# EAGLE design v3 (EAGLE 6.3)
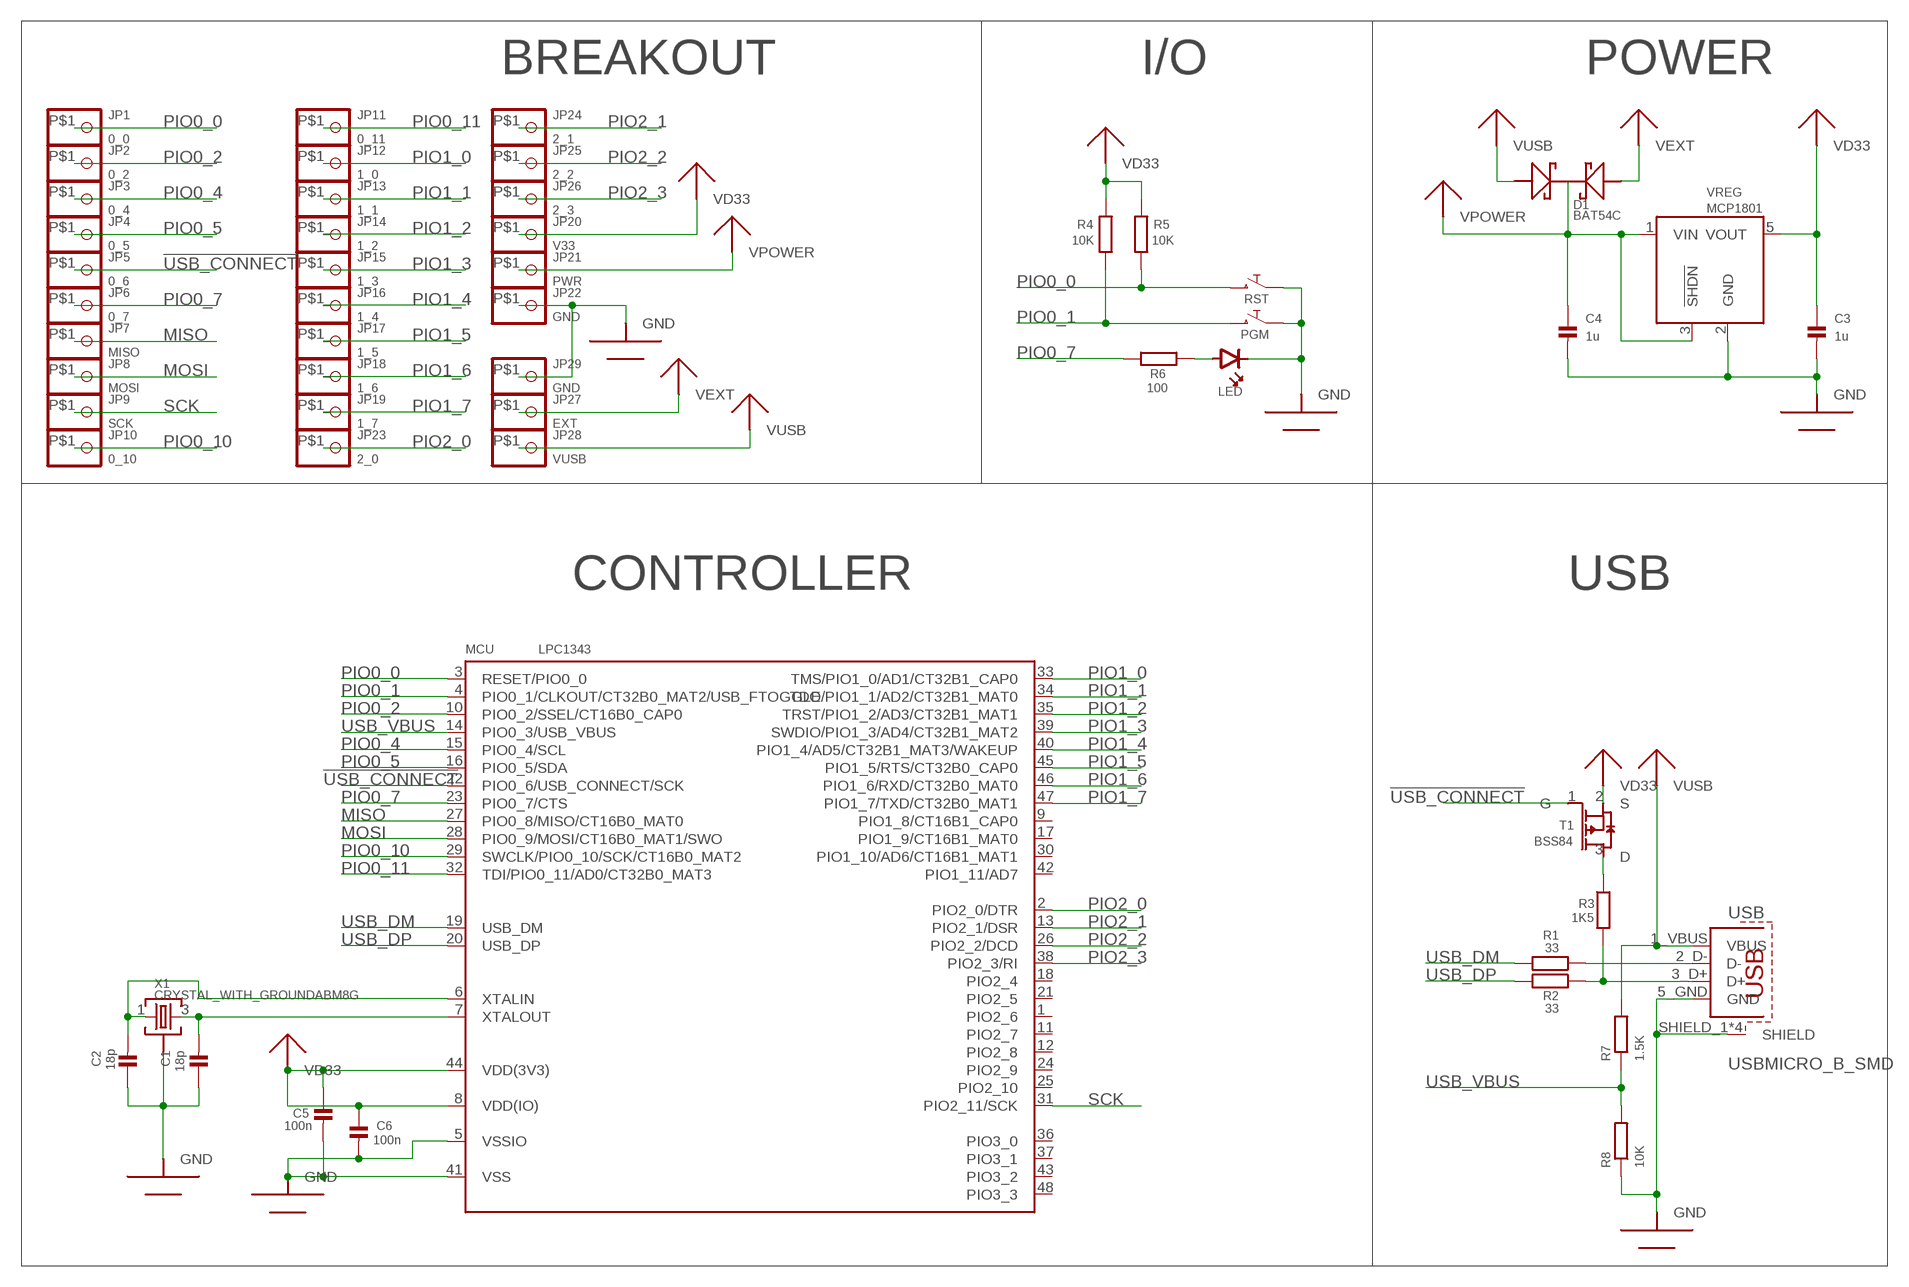
[diagram p0: schematic, sheet 1]

## Parts
C1  18p  CAP_CERAMIC0603  [0603]
C2  18p  CAP_CERAMIC0603  [0603]
C3  1u  CAP_CERAMIC0603  [0603]
C4  1u  CAP_CERAMIC0603  [0603]
C5  100n  CAP_CERAMIC0603  [0603]
C6  100n  CAP_CERAMIC0603  [0603]
D1  BAT54C  [SOT323]
JP1  0_0  HEADER-1X1SMD_MEDIUM  [PCB_MEDIUM_RECT_PAD]
JP2  0_2  HEADER-1X1SMD_MEDIUM  [PCB_MEDIUM_RECT_PAD]
JP3  0_4  HEADER-1X1SMD_MEDIUM  [PCB_MEDIUM_RECT_PAD]
JP4  0_5  HEADER-1X1SMD_MEDIUM  [PCB_MEDIUM_RECT_PAD]
JP5  0_6  HEADER-1X1SMD_MEDIUM  [PCB_MEDIUM_RECT_PAD]
JP6  0_7  HEADER-1X1SMD_MEDIUM  [PCB_MEDIUM_RECT_PAD]
JP7  MISO  HEADER-1X1SMD_MEDIUM  [PCB_MEDIUM_RECT_PAD]
JP8  MOSI  HEADER-1X1SMD_MEDIUM  [PCB_MEDIUM_RECT_PAD]
JP9  SCK  HEADER-1X1SMD_MEDIUM  [PCB_MEDIUM_RECT_PAD]
JP10  0_10  HEADER-1X1SMD_MEDIUM  [PCB_MEDIUM_RECT_PAD]
JP11  0_11  HEADER-1X1SMD_MEDIUM  [PCB_MEDIUM_RECT_PAD]
JP12  1_0  HEADER-1X1SMD_MEDIUM  [PCB_MEDIUM_RECT_PAD]
JP13  1_1  HEADER-1X1SMD_MEDIUM  [PCB_MEDIUM_RECT_PAD]
JP14  1_2  HEADER-1X1SMD_MEDIUM  [PCB_MEDIUM_RECT_PAD]
JP15  1_3  HEADER-1X1SMD_MEDIUM  [PCB_MEDIUM_RECT_PAD]
JP16  1_4  HEADER-1X1SMD_MEDIUM  [PCB_MEDIUM_RECT_PAD]
JP17  1_5  HEADER-1X1SMD_MEDIUM  [PCB_MEDIUM_RECT_PAD]
JP18  1_6  HEADER-1X1SMD_MEDIUM  [PCB_MEDIUM_RECT_PAD]
JP19  1_7  HEADER-1X1SMD_MEDIUM  [PCB_MEDIUM_RECT_PAD]
JP20  V33  HEADER-1X1SMD_MEDIUM  [PCB_MEDIUM_RECT_PAD]
JP21  PWR  HEADER-1X1SMD_MEDIUM  [PCB_MEDIUM_RECT_PAD]
JP22  GND  HEADER-1X1SMD_MEDIUM  [PCB_MEDIUM_RECT_PAD]
JP23  2_0  HEADER-1X1SMD_MEDIUM  [PCB_MEDIUM_RECT_PAD]
JP24  2_1  HEADER-1X1SMD_MEDIUM  [PCB_MEDIUM_RECT_PAD]
JP25  2_2  HEADER-1X1SMD_MEDIUM  [PCB_MEDIUM_RECT_PAD]
JP26  2_3  HEADER-1X1SMD_MEDIUM  [PCB_MEDIUM_RECT_PAD]
JP27  EXT  HEADER-1X1SMD_LARGER  [PCB_LARGER_RECT_PAD]
JP28  VUSB  HEADER-1X1SMD_LARGER  [PCB_LARGER_RECT_PAD]
JP29  GND  HEADER-1X1SMD_LARGER  [PCB_LARGER_RECT_PAD]
LED  LED0603  [0603_POLAR]
MCU  LPC1343  LPC1343_QFP  [LQFP48]
PGM  PUSHBUTTONKMR2XX  [CK-KMR2]
R1  33  R-EU_0603  [0603]
R2  33  R-EU_0603  [0603]
R3  1K5  R-EU_0603  [0603]
R4  10K  R-EU_0603  [0603]
R5  10K  R-EU_0603  [0603]
R6  100  R-EU_0603  [0603]
R7  1.5K  R-EU_0603  [0603]
R8  10K  R-EU_0603  [0603]
RST  PUSHBUTTONKMR2XX  [CK-KMR2]
T1  BSS84  PMOS_ENH  [SOT23]
USB  USBMICRO_B_SMD  [MICRO_USB_B_SMD]
VREG  MCP1801  MCP180XSOT-23-5  [SOT-23-5]
X1  CRYSTAL_WITH_GROUNDABM8G  [ABM8G]

## Nets
!USB_CONNECT: JP5.P$1 MCU.22(PIO0_6/USB_CONNECT/SCK) T1.1(G)
GND: C1.1 C2.1 C3.2 C4.2 C5.2 C6.2 JP22.P$1 JP29.P$1 LED.K(CATHODE) MCU.5(VSSIO) MCU.41(VSS) PGM.P$1 PGM.P$2 R8.1 RST.P$1 RST.P$2 USB.5_GND(GND) USB.SHIELD_1(SHIELD) USB.SHIELD_2(SHIELD) USB.SHIELD_3(SHIELD) USB.SHIELD_4(SHIELD) VREG.2(GND) X1.2(GND) X1.4(GND)
MISO: JP7.P$1 MCU.27(PIO0_8/MISO/CT16B0_MAT0)
MOSI: JP8.P$1 MCU.28(PIO0_9/MOSI/CT16B0_MAT1/SWO)
N$1: C2.2 MCU.6(XTALIN) X1.1
N$2: C1.2 MCU.7(XTALOUT) X1.3
N$3: R3.1 T1.3(D)
N$4: R1.1 USB.2_D-(D-)
N$5: LED.A(ANODE) R6.1
PIO0_0: JP1.P$1 MCU.3(RESET/PIO0_0) R5.1 RST.P$3 RST.P$4
PIO0_1: MCU.4(PIO0_1/CLKOUT/CT32B0_MAT2/USB_FTOGGLE) PGM.P$3 PGM.P$4 R4.1
PIO0_2: JP2.P$1 MCU.10(PIO0_2/SSEL/CT16B0_CAP0)
PIO0_4: JP3.P$1 MCU.15(PIO0_4/SCL)
PIO0_5: JP4.P$1 MCU.16(PIO0_5/SDA)
PIO0_7: JP6.P$1 MCU.23(PIO0_7/CTS) R6.2
PIO0_10: JP10.P$1 MCU.29(SWCLK/PIO0_10/SCK/CT16B0_MAT2)
PIO0_11: JP11.P$1 MCU.32(TDI/PIO0_11/AD0/CT32B0_MAT3)
PIO1_0: JP12.P$1 MCU.33(TMS/PIO1_0/AD1/CT32B1_CAP0)
PIO1_1: JP13.P$1 MCU.34(TDO/PIO1_1/AD2/CT32B1_MAT0)
PIO1_2: JP14.P$1 MCU.35(TRST/PIO1_2/AD3/CT32B1_MAT1)
PIO1_3: JP15.P$1 MCU.39(SWDIO/PIO1_3/AD4/CT32B1_MAT2)
PIO1_4: JP16.P$1 MCU.40(PIO1_4/AD5/CT32B1_MAT3/WAKEUP)
PIO1_5: JP17.P$1 MCU.45(PIO1_5/RTS/CT32B0_CAP0)
PIO1_6: JP18.P$1 MCU.46(PIO1_6/RXD/CT32B0_MAT0)
PIO1_7: JP19.P$1 MCU.47(PIO1_7/TXD/CT32B0_MAT1)
PIO2_0: JP23.P$1 MCU.2(PIO2_0/DTR)
PIO2_1: JP24.P$1 MCU.13(PIO2_1/DSR)
PIO2_2: JP25.P$1 MCU.26(PIO2_2/DCD)
PIO2_3: JP26.P$1 MCU.38(PIO2_3/RI)
SCK: JP9.P$1 MCU.31(PIO2_11/SCK)
USB_D+: R2.1 R3.2 USB.3_D+(D+)
USB_DM: MCU.19(USB_DM) R1.2
USB_DP: MCU.20(USB_DP) R2.2
USB_VBUS: MCU.14(PIO0_3/USB_VBUS) R7.1 R8.2
VD33: C3.1 C5.1 C6.1 JP20.P$1 MCU.8(VDD(IO)) MCU.44(VDD(3V3)) R4.2 R5.2 T1.2(S) VREG.5(VOUT)
VEXT: D1.2(ANODE2) JP27.P$1
VPOWER: C4.1 D1.3(CATHODE) JP21.P$1 VREG.1(VIN) VREG.3(!SHDN)
VUSB: D1.1(ANODE1) JP28.P$1 R7.2 USB.1_VBUS(VBUS)
Unconnected: MCU.1(PIO2_6) MCU.9(PIO1_8/CT16B1_CAP0) MCU.11(PIO2_7) MCU.12(PIO2_8) MCU.17(PIO1_9/CT16B1_MAT0) MCU.18(PIO2_4) MCU.21(PIO2_5) MCU.24(PIO2_9) MCU.25(PIO2_10) MCU.30(PIO1_10/AD6/CT16B1_MAT1) MCU.36(PIO3_0) MCU.37(PIO3_1) MCU.42(PIO1_11/AD7) MCU.43(PIO3_2) MCU.48(PIO3_3)

## Notes on the sheet
- BREAKOUT | I/O | POWER
- CONTROLLER | USB

## Library data of the parts
C1-C6 = MEINZEUG:CAP_CERAMIC: Ceramic Capacitors 0603 - 0603 Surface Mount Capacitors 3pF 250V +/-0.1pF RF Ceramic Capacitor[Digikey: 712-1347-1-ND] 16 pF 50V 5% Ceramic Capacitor[Digikey: 445-5051-2-ND] 18 pF 250V 5% RF Ceramic Capcitor [Digikey: 478-3505-1-ND] 22 pF 50V Ceramic Capacitor [Digikey: PCC220ACVTR-ND] 33 pF 50V 5% Ceramic Capacitor 56 pF 250V 5% C0G RF Ceramic Capcitor [Digikey: 490-4867-1-ND] 680 pF 50V Ceramic Capacitor 2200 pF 50V 5% C0G Ceramic Capacitor [Digikey: 445-1297-1-ND] 5600 pF 100V 5% X7R Ceramic Capacitor [Digikey: 478-3711-1-ND] 0.1 µF 25V 10% Ceramic Capacitor [Digikey: PCC2277TR-ND] 0.22 µF 16V 10% X7R Ceramic Capacitor [Digikey: 445-1318-1-ND] 1.0 µF 25V 10% Ceramic Capacitor [Digikey: 445-5146-2-ND] 0805 - 0805 Surface Mount Capacitors 220 pF 250V 2% RF Ceramic Capacitor [Digikey: 712-1398-1-ND] 1000 pF 50V 2% NP0 Ceramic Capacitor [Digikey: 478-3760-1-ND] 0.1 µF 25V 10% Ceramic Capacitor [Digikey: PCC1828TR-ND] 1.0 µF 16V 10% Ceramic Capacitor[Digikey: 490-1691-2-ND] 10.0 µF 10V 10% Ceramic Capacitor[Digikey: 709-1228-1-ND] 1206 - 1206 Surface Mount Capacitors
D1 = MEINZEUG:BAT54C
JP1-JP29 = MEINZEUG:HEADER-1X1: PIN HEADER
LED = MEINZEUG:LED: LED common
MCU = MEINZEUG:LPC1343_QFP: LPC1343 72 MHz 32-bit ARM Cortex-M3 microcontroller. 32 kB Flash, 8 kB SRAM, USB Device Mouser: 771-LPC1343FBD48151 Digikey: 568-4945-ND
PGM RST = MEINZEUG:PUSHBUTTON: Push button 1 x momentary close switches
R1-R8 = MEINZEUG:R-EU_: RESISTOR, European symbol
T1 = MEINZEUG:PMOS_ENH: P-Channel MOSFET, enhancement type
USB = MEINZEUG:USB: BERG USB connector
VREG = MEINZEUG:MCP180X: Cheap Microchip LDO
X1 = MEINZEUG:CRYSTAL_WITH_GROUND

## Board
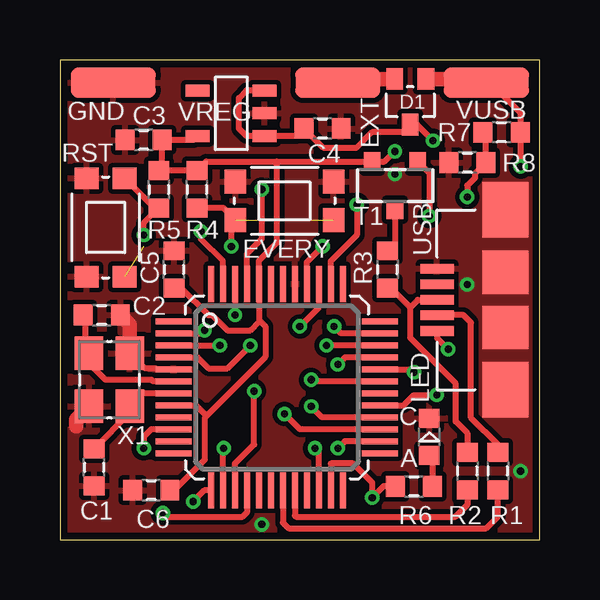
[diagram p1: board, top side]
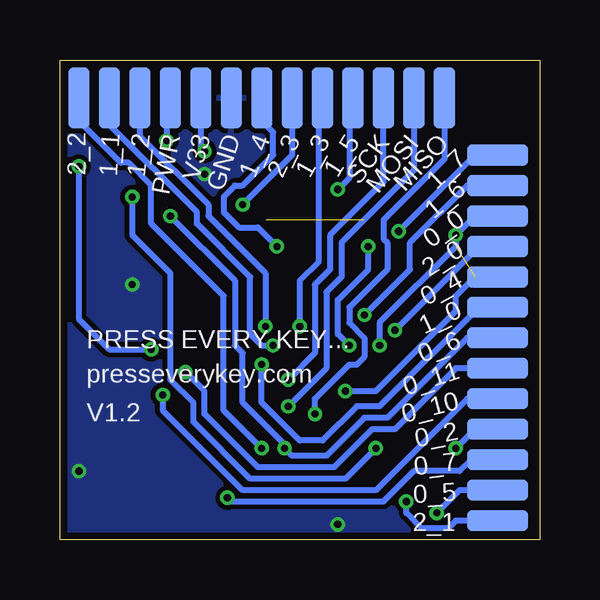
[diagram p2: board, bottom side, seen from below]

Size 20 x 20 mm. Coordinates in mm from the lower left corner, seen from the top.
Outline: 0,0 20,0 20,20 0,20 0,0
Copper layers (1*16): Top 0.035mm / dielectric 1.5mm / Bottom 0.035mm
Design rules "default": minimum track width 0.2mm, minimum drill 0.3mm, track to track 0.2mm, track to pad 0.2mm, pad to pad 0.2mm, via to via 0.2mm, smd to smd 0.2mm, copper to edge 0.3mm, drill to drill 0.2mm, minimum pad ring 0.2mm, minimum via ring 0.15mm, stop-mask expansion 0.075mm, vias tented up to drill 12mil, thermal gap 0.2mm
tKeepout: area 0,18.5 to 1.5,20; area 18.5,18.5 to 20,20; area 0,0 to 1.5,1.5; area 18.5,0 to 20,1.5

### Footprints (pad centres in the part's own frame; a part is rotated, then mirrored left to right if it is on the bottom)
0603 = smd 0.787 x 0.864: 1 -0.775,0; 2 0.775,0
SOT323 = smd 0.7 x 0.9: 1 -0.65,-0.95; 2 0.65,-0.95; 3 0,0.95
PCB_MEDIUM_RECT_PAD = smd 2.54 x 0.889: P$1 0,0
PCB_LARGER_RECT_PAD = smd 3.556 x 1.27: P$1 0,0
0603_POLAR = smd 0.787 x 0.864: A -0.775,0; K 0.775,0
LQFP48 = smd 1.5 x 0.25: 1 -4.3,2.75; 2 -4.3,2.25; 3 -4.3,1.75; 4 -4.3,1.25; 5 -4.3,0.75; 6 -4.3,0.25; 7 -4.3,-0.25; 8 -4.3,-0.75; 9 -4.3,-1.25; 10 -4.3,-1.75; 11 -4.3,-2.25; 12 -4.3,-2.75; 25 4.3,-2.75; 26 4.3,-2.25; 27 4.3,-1.75; 28 4.3,-1.25; 29 4.3,-0.75; 30 4.3,-0.25; 31 4.3,0.25; 32 4.3,0.75; 33 4.3,1.25; 34 4.3,1.75; 35 4.3,2.25; 36 4.3,2.75 | smd 0.25 x 1.5: 13 -2.75,-4.3; 14 -2.25,-4.3; 15 -1.75,-4.3; 16 -1.25,-4.3; 17 -0.75,-4.3; 18 -0.25,-4.3; 19 0.25,-4.3; 20 0.75,-4.3; 21 1.25,-4.3; 22 1.75,-4.3; 23 2.25,-4.3; 24 2.75,-4.3; 37 2.75,4.3; 38 2.25,4.3; 39 1.75,4.3; 40 1.25,4.3; 41 0.75,4.3; 42 0.25,4.3; 43 -0.25,4.3; 44 -0.75,4.3; 45 -1.25,4.3; 46 -1.75,4.3; 47 -2.25,4.3; 48 -2.75,4.3
CK-KMR2 = smd 1 x 0.9: P$1 -0.8,2.05; P$2 -0.8,-2.05; P$3 0.8,2.05; P$4 0.8,-2.05
SOT23 = smd 0.7 x 0.8: 1 -0.95,-1; 2 0.95,-1; 3 0,1
MICRO_USB_B_SMD = smd 0.4 x 1.4: 1_VBUS -1.3,2.85; 2_D- -0.65,2.85; 3_D+ 0,2.85; 4_ID_NC 0.65,2.85; 5_GND 1.3,2.85 | smd 2.3 x 1.9: SHIELD_1 -3.75,0; SHIELD_4 3.75,0 | smd 1.8 x 1.9: SHIELD_2 -1.15,0; SHIELD_3 1.15,0
SOT-23-5 = smd 0.5 x 1: 1 -0.95,-1.397; 2 0,-1.397; 3 0.95,-1.397; 4 0.95,1.397; 5 -0.95,1.397
ABM8G = smd 1.397 x 1.194: 1 -1.105,-0.851; 2 1.105,-0.851; 3 1.105,0.851; 4 -1.105,0.851

### Placement (x,y rotation side)
C1  1.43,3.02 90 top
C2  1.75,9.37 180 top
C3  3.49,16.67 180 top
C4  10.95,17.14 0 top
C5  4.76,11.27 90 top
C6  3.81,2.06 180 top
D1  14.61,18.26 180 top
JP1  1.75,13.49 180 bottom
JP2  1.75,4.6 180 bottom
JP3  1.75,10.95 180 bottom
JP4  1.75,2.06 180 bottom
JP5  1.75,8.41 180 bottom
JP6  1.75,3.33 180 bottom
JP7  3.97,18.41 270 bottom
JP8  5.24,18.41 270 bottom
JP9  6.51,18.41 270 bottom
JP10  1.75,5.87 180 bottom
JP11  1.75,7.14 180 bottom
JP12  1.75,9.68 180 bottom
JP13  17.94,18.41 270 bottom
JP14  16.67,18.41 270 bottom
JP15  9.05,18.41 270 bottom
JP16  11.59,18.41 270 bottom
JP17  7.78,18.41 270 bottom
JP18  1.75,14.76 180 bottom
JP19  1.75,16.03 180 bottom
JP20  14.13,18.41 270 bottom
JP21  15.4,18.41 270 bottom
JP22  12.86,18.41 270 bottom
JP23  1.75,12.22 180 bottom
JP24  1.75,0.79 180 bottom
JP25  19.21,18.41 270 bottom
JP26  10.32,18.41 270 bottom
JP27  11.59,19.05 0 top
JP28  17.78,19.05 0 top
JP29  2.22,19.05 180 top
LED  15.4,4.29 90 top
MCU  9.05,6.35 0 top
PGM  9.37,14.13 270 top
R1  18.26,2.86 270 top
R2  16.99,2.86 270 top
R3  13.65,11.27 270 top
R4  5.71,14.61 90 top
R5  4.13,14.61 90 top
R6  14.76,2.22 180 top
R7  18.41,16.99 0 top
R8  16.99,15.72 0 top
RST  1.91,13.02 0 top
T1  13.97,14.76 180 top
USB  18.57,10 90 top
VREG  7.14,17.78 90 top
X1  2.06,6.67 270 top

### Tracks (layer width: path | path; a pad name or v marks a point on that pad's centre or on a via)
!USB_CONNECT  (via drill 0.3)
  Top 0.254: MCU.22 10.8,3.65 v10.64,3.81 | T1.1 15.4,15.29 v15.4,13.49
  Bottom 0.254: JP5.P$1 3.02,8.41 6.35,5.08 7.3,5.08 8.89,3.49 10.32,3.49 v10.64,3.81 10.64,3.97 12.38,5.71 12.38,7.78 12.7,8.1 12.7,10.79 v15.4,13.49
GND  (via drill 0.3)
  Top 0.254: C2.1 2.52,9.23 | MCU.5 4.01,7.1 3.97,7.14 3.54,7.14 X1.4
  Top 0.61: X1.4 2.92,8.97 C2.1 | X1.2 0.67,5.02 0.67,4.72
  other vias: 13.97,15.24 19.21,2.86 16.99,10.64 8.41,0.64
  pour Top (isolate 0.051): 0.16,0 0.16,19.87 20.03,19.87 20.03,0
  pour Bottom (isolate 0.051): 0.16,0 20.03,0 20.03,19.87 0.16,19.87
MISO  (via drill 0.3)
  Top 0.254: MCU.27 10.01,4.6 v9.37,5.24
  Bottom 0.254: JP7.P$1 3.97,15.88 6.51,13.34 6.51,12.54 6.35,12.38 6.35,11.27 7.94,9.68 7.94,9.05 7.3,8.41 7.3,7.62 7.62,7.3 7.94,7.3 9.37,5.87 v9.37,5.24
MOSI  (via drill 0.3)
  Top 0.254: MCU.28 10.93,5.1 v10.48,5.56
  Bottom 0.254: JP8.P$1 5.24,15.4 8.26,12.38 8.26,10.95 8.89,10.32 8.89,7.14 v10.48,5.56
N$1
  Top 0.254: C2.2 1.05,9.28 1.05,7.93 X1.1 1.27,7.71 1.43,7.71 1.43,7.14 1.91,6.67 3.81,6.67 3.88,6.6 MCU.6
N$2
  Top 0.254: MCU.7 3.45,6.1 X1.3 2.92,5.28 C1.2
N$3
  Top 0.254: T1.3 13.97,12.36 R3.1
N$4
  Top 0.254: R1.1 18.26,3.97 17.14,5.08 17.14,9.05 16.83,9.37 15.74,9.37 USB.2_D-
N$5
  Top 0.254: LED.A 15.54,3.37 R6.1
PIO0_0  (via drill 0.3)  (1 unrouted)
  Top 0.254: v3.49,12.7 3.49,13.2 R5.1 3.94,13.83 RST.P$3 | MCU.3 v6.66,8.1 v6.67,8.1
  Bottom 0.254: JP1.P$1 2.7,13.49 v3.49,12.7 3.49,12.22 6.67,9.05 v6.67,8.1
PIO0_1  (via drill 0.3)  (1 unrouted)
  Top 0.254: MCU.4 5.74,7.6 6.19,7.14 6.99,7.14 v7.94,8.1 | v7.14,12.22 7.16,12.24 7.16,13.17 PGM.P$4 6.82,13.83 R4.1
  Bottom 0.254: v7.94,8.1 8.41,8.57 8.41,10 7.14,11.27 v7.14,12.22
PIO0_2  (via drill 0.3)
  Top 0.254: MCU.10 3.81,4.6 3.49,4.29 v3.49,3.81
  Bottom 0.254: JP2.P$1 2.7,4.6 v3.49,3.81
PIO0_4  (via drill 0.3)
  Top 0.254: MCU.15 7.3,3.17 8.1,3.97 v8.1,6.19
  Bottom 0.254: v8.1,6.19 6.83,6.19 3.49,9.53 3.49,10.16 2.7,10.95 JP3.P$1
PIO0_5  (via drill 0.3)
  Top 0.254: MCU.16 7.8,1.13 7.62,0.95 4.45,0.95 v4.29,1.11
  Bottom 0.254: JP4.P$1 3.33,2.06 v4.29,1.11
PIO0_7  (via drill 0.3)
  Top 0.254: MCU.23 11.3,3.17 12.22,3.17 13.02,2.38 v13.02,1.75 13.49,2.22 R6.2
  Bottom 0.254: JP6.P$1 2.86,3.33 3.33,2.86 5.24,2.86 6.51,1.59 12.86,1.59 v13.02,1.75
PIO0_10  (via drill 0.3)
  Top 0.254: MCU.29 14.33,5.6 14.76,6.03 v15.72,6.03
  Bottom 0.254: v15.72,6.03 15.72,5.4 12.38,2.06 6.83,2.06 3.02,5.87 JP10.P$1
PIO0_11  (via drill 0.3)
  Top 0.254: MCU.32 14.65,7.1 v14.76,6.99
  Bottom 0.254: v14.76,6.99 13.97,6.19 13.97,5.24 11.75,3.02 8.57,3.02 6.99,4.6 6.03,4.6 3.49,7.14 JP11.P$1
PIO1_0  (via drill 0.3)
  Top 0.254: MCU.33 11.89,7.6 v11.59,7.3
  Bottom 0.254: v11.59,7.3 11.59,5.71 10,4.13 9.05,4.13 7.62,5.56 6.67,5.56 2.54,9.68 JP12.P$1
PIO1_1  (via drill 0.3)
  Top 0.254: MCU.34 v11.12,8.1 v11.11,8.1
  Bottom 0.254: JP13.P$1 17.94,17.3 14.29,13.65 14.29,13.18 12.06,10.95 12.06,8.57 11.59,8.1 v11.11,8.1
PIO1_2  (via drill 0.3)
  Top 0.254: MCU.35 11.72,8.6 v11.43,8.89
  Bottom 0.254: JP14.P$1 16.67,16.83 13.81,13.97 13.81,13.49 11.43,11.11 v11.43,8.89
PIO1_3  (via drill 0.3)
  Top 0.254: MCU.39 10.8,9.69 v10,8.89
  Bottom 0.254: v10,8.89 10,10.79 9.21,11.59 9.21,18.26 JP15.P$1
PIO1_4  (via drill 0.3)
  Top 0.254: MCU.40 10.3,11.57 v10.95,12.22
  Bottom 0.254: v10.95,12.22 11.75,13.02 12.54,13.02 13.18,13.65 13.18,14.29 12.7,14.76 12.38,14.76 11.11,16.03 11.11,16.99 11.59,17.46 JP16.P$1
PIO1_5  (via drill 0.3)
  Top 0.254: MCU.45 7.8,11.93 8.41,12.54 v8.41,14.61
  Bottom 0.254: JP17.P$1 7.94,18.26 7.94,15.08 v8.41,14.61
PIO1_6  (via drill 0.3)
  Top 0.254: MCU.46 v7.3,9.37
  Bottom 0.254: JP18.P$1 3.02,14.76 5.4,12.38 5.4,11.27 v7.3,9.37
PIO1_7  (via drill 0.3)
  Top 0.254: MCU.47 6.8,11.62 5.87,12.54 v5.87,12.86
  Bottom 0.254: JP19.P$1 2.7,16.03 v5.87,12.86
PIO2_0  (via drill 0.3)
  Top 0.254: MCU.2 5.9,8.6 v6.03,8.73
  Bottom 0.254: JP23.P$1 2.54,12.22 v6.03,8.73
PIO2_1  (via drill 0.3)
  Top 0.254: MCU.13 6.02,2.05 v5.56,1.59
  Bottom 0.254: JP24.P$1 3.49,0.79 3.81,0.48 4.92,0.48 5.56,1.11 v5.56,1.59
PIO2_2  (via drill 0.3)
  Top 0.254: MCU.26 11.88,4.1 v11.59,3.81
  Bottom 0.254: v11.59,3.81 13.18,5.4 13.18,10.16 16.19,13.18 16.19,14.76 17.14,15.72 17.46,15.72 19.21,17.46 JP25.P$1
PIO2_3  (via drill 0.3)
  Top 0.254: MCU.38 11.3,11.62 12.38,12.7 v12.38,13.97
  Bottom 0.254: JP26.P$1 10.32,16.03 v12.38,13.97
SCK  (via drill 0.3)
  Top 0.254: MCU.31 10.54,6.6 v10.48,6.67
  Bottom 0.254: 10.32,6.83 v10.48,6.67 9.37,7.78 9.37,10.64 8.73,11.27 8.73,12.7 6.51,14.92 JP9.P$1
USB_D+
  Top 0.254: 14.61,9.68 14.61,8.41 16.51,6.51 16.51,4.92 16.99,4.45 R2.1 | 13.63,10.5 R3.2 13.79,10.5 14.61,9.68 | 14.61,9.68 14.92,10 USB.3_D+
USB_DM
  Top 0.254: MCU.19 9.3,0.7 9.53,0.48 17.78,0.48 18.26,0.95 R1.2
USB_DP
  Top 0.254: MCU.20 9.8,1 9.84,0.95 16.49,0.95 16.99,1.45 R2.2
USB_VBUS  (via drill 0.3)
  Top 0.254: MCU.14 6.8,3.78 v6.83,3.81 | v16.99,14.29 16.99,14.76 17.3,15.08 17.3,15.26 R8.2 17.76,16.87 R7.1 17.6,16.95
  Bottom 0.254: v6.83,3.81 8.1,2.54 12.06,2.54 14.45,4.92 14.45,5.71 15.4,6.67 15.4,11.11 16.99,12.7 v16.99,14.29
VD33  (via drill 0.3)
  Top 0.254: C6.1 4.76,2.06 6.03,3.33 6.03,5.08 6.11,5.16 | 8.3,9.09 MCU.44 8.3,11.63 9.05,12.38 9.05,15.76 | 8.3,9.09 7.94,8.73 6.99,8.73 6.35,9.37 6.19,9.37 5.06,10.5 C5.1 | 6.11,5.16 8.57,7.62 8.57,8.89 8.37,9.09 8.3,9.09 | MCU.8 5.67,5.6 6.11,5.16 | R4.2 5.71,15.24 | R4.2 R5.2 4.27,15.52 C3.1 5.58,16.67 VREG.5 | R4.2 6.1,15.76 9.05,15.76 | 9.05,15.76 T1.2 13.54,15.76 v13.97,16.19
  Bottom 0.254: JP20.P$1 14.13,16.35 v13.97,16.19
VEXT
  Top 0.61: D1.2 11.59,19.21 11.59,19.2 JP27.P$1
VPOWER  (via drill 0.3)
  Top 0.254: VREG.3 7.78,18.73 7.46,18.41 7.46,17.14 7.78,16.83 VREG.1 9.86,16.83 C4.1 10.97,16.35 12.38,16.35 13.02,16.99 14.29,16.99 D1.3 | D1.3 14.76,17.31 | v15.56,16.64 14.89,17.31 D1.3
  Bottom 0.254: JP21.P$1 15.56,18.26 v15.56,16.64
VUSB  (via drill 0.3)
  Top 0.254: USB.1_VBUS 15.72,8.41 v16.19,7.94 | 17.78,19.21 17.86,19.13 | v19.21,15.56 19.21,16.97 R7.2 19.19,17.8 17.94,19.05 JP28.P$1
  Top 0.406: 17.94,19.05 17.86,19.05 17.86,19.13
  Top 0.61: D1.1 17.78,19.21
  Bottom 0.254: v19.21,15.56 19.21,9.21 17.94,7.94 v16.19,7.94

### Text on the board
tPlace: C | A
bPlace: PRESS EVERY KEY... | presseverykey.com | V1.2
tNames: EVERY